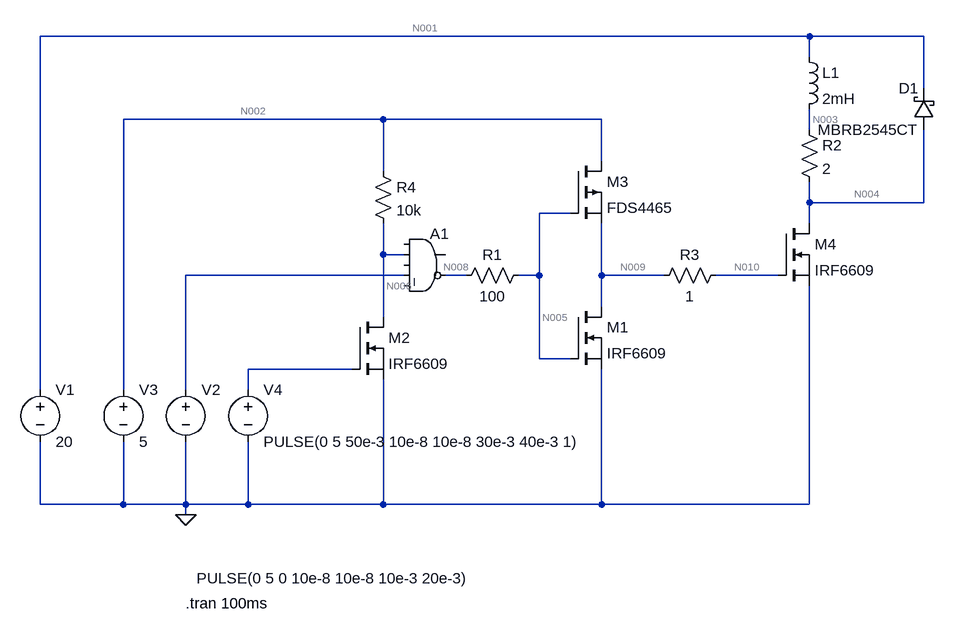
[diagram p0: schematic OpenDrainDriver.asc]
OpenDrainDriver.asc, the LTspice schematic file:
Version 4
SHEET 1 1212 680
WIRE 912 -400 -272 -400
WIRE 1088 -400 912 -400
WIRE 912 -368 912 -400
WIRE 1088 -320 1088 -400
WIRE 256 -272 -144 -272
WIRE 592 -272 256 -272
WIRE 912 -256 912 -288
WIRE 592 -208 592 -272
WIRE 256 -192 256 -272
WIRE 912 -144 912 -176
WIRE 1088 -144 1088 -256
WIRE 1088 -144 912 -144
WIRE 544 -128 496 -128
WIRE 912 -112 912 -144
WIRE 256 -64 256 -112
WIRE 288 -64 256 -64
WIRE 288 -32 -48 -32
WIRE 384 -32 352 -32
WIRE 496 -32 496 -128
WIRE 496 -32 464 -32
WIRE 592 -32 592 -112
WIRE 688 -32 592 -32
WIRE 864 -32 768 -32
WIRE 592 16 592 -32
WIRE 256 32 256 -64
WIRE 496 96 496 -32
WIRE 544 96 496 96
WIRE 208 112 48 112
WIRE -272 144 -272 -400
WIRE -144 144 -144 -272
WIRE -48 144 -48 -32
WIRE 48 144 48 112
WIRE -272 320 -272 224
WIRE -144 320 -144 224
WIRE -144 320 -272 320
WIRE -48 320 -48 224
WIRE -48 320 -144 320
WIRE 48 320 48 224
WIRE 48 320 -48 320
WIRE 256 320 256 128
WIRE 256 320 48 320
WIRE 592 320 592 112
WIRE 592 320 256 320
WIRE 912 320 912 -16
WIRE 912 320 592 320
WIRE -48 336 -48 320
FLAG -48 336 0
SYMBOL voltage -272 128 R0
WINDOW 123 0 0 Left 0
WINDOW 39 0 0 Left 0
SYMATTR InstName V1
SYMATTR Value 20
SYMBOL voltage -48 128 R0
WINDOW 3 17 306 Left 2
WINDOW 123 0 0 Left 0
WINDOW 39 0 0 Left 0
SYMATTR Value PULSE(0 5 0 10e-8 10e-8 10e-3 20e-3)
SYMATTR InstName V2
SYMBOL nmos 544 16 R0
SYMATTR InstName M1
SYMATTR Value IRF6609
SYMBOL pmos 544 -208 R0
SYMATTR InstName M3
SYMATTR Value FDS4465
SYMBOL res 480 -48 R90
WINDOW 0 0 56 VBottom 2
WINDOW 3 32 56 VTop 2
SYMATTR InstName R1
SYMATTR Value 100
SYMBOL res 896 -272 R0
SYMATTR InstName R2
SYMATTR Value 2
SYMBOL ind 896 -384 R0
SYMATTR InstName L1
SYMATTR Value 2mH
SYMBOL voltage -144 128 R0
WINDOW 123 0 0 Left 0
WINDOW 39 0 0 Left 0
SYMATTR InstName V3
SYMATTR Value 5
SYMBOL nmos 864 -112 R0
SYMATTR InstName M4
SYMATTR Value IRF6609
SYMBOL schottky 1104 -256 R180
WINDOW 0 24 64 Left 2
WINDOW 3 24 0 Left 2
SYMATTR InstName D1
SYMATTR Value MBRB2545CT
SYMATTR Description Diode
SYMATTR Type diode
SYMBOL res 784 -48 R90
WINDOW 0 0 56 VBottom 2
WINDOW 3 32 56 VTop 2
SYMATTR InstName R3
SYMATTR Value 1
SYMBOL Digital\\and 320 -112 R0
SYMATTR InstName A1
SYMATTR SpiceLine Vhigh=5V
SYMBOL res 240 -208 R0
SYMATTR InstName R4
SYMATTR Value 10k
SYMBOL voltage 48 128 R0
WINDOW 123 0 0 Left 0
WINDOW 39 0 0 Left 0
SYMATTR InstName V4
SYMATTR Value PULSE(0 5 50e-3 10e-8 10e-8 30e-3 40e-3 1)
SYMBOL nmos 208 32 R0
SYMATTR InstName M2
SYMATTR Value IRF6609
TEXT -48 472 Left 2 !.tran 100ms

The netlist it stands for:
* OpenDrainDriver.asc
V1 N001 0 20
V2 N007 0 PULSE(0 5 0 10e-8 10e-8 10e-3 20e-3)
M1 N009 N005 0 0 IRF6609
M3 N002 N005 N009 N009 FDS4465
R1 N005 N008 100
R2 N003 N004 2
L1 N001 N003 2mH
V3 N002 0 5
M4 N004 N010 0 0 IRF6609
D1 N004 N001 MBRB2545CT
R3 N010 N009 1
A1 0 N006 0 N007 0 N008 0 0 AND Vhigh=5V
R4 N002 N006 10k
V4 N011 0 PULSE(0 5 50e-3 10e-8 10e-8 30e-3 40e-3 1)
M2 N006 N011 0 0 IRF6609
.model D D
.lib standard.dio
.model NMOS NMOS
.model PMOS PMOS
.lib standard.mos
.tran 100ms
.backanno
.end

* Results of the author's LTspice run, read from the files saved beside the schematic
* Operating Point, zero values left out:
*   V(n001) = 20 V
*   V(n009) = 1.902 V
*   V(n005) = 5 V
*   V(n002) = 5 V
*   V(n008) = 5 V
*   V(n003) = 20 V
*   V(n004) = 20 V
*   V(n010) = 1.902 V
*   V(n006) = 5 V
*   Id(M3) = 243.8 A
*   Is(M3) = -243.8 A
*   Id(M2) = 97.7 pA
*   Is(M2) = -97.7 pA
*   Id(M4) = 459.7 nA
*   Is(M4) = -459.7 nA
*   Id(M1) = 243.8 A
*   Is(M1) = -243.8 A
*   I(D1) = -1.066 pA
*   I(L1) = 459.7 nA
*   I(R4) = 103.5 pA
*   I(R2) = 459.7 nA
*   I(V3) = -243.8 A
*   I(V1) = -459.7 nA